# Altium schematic sheet Mainboard_MCU_Breakout.SchDoc
size A4
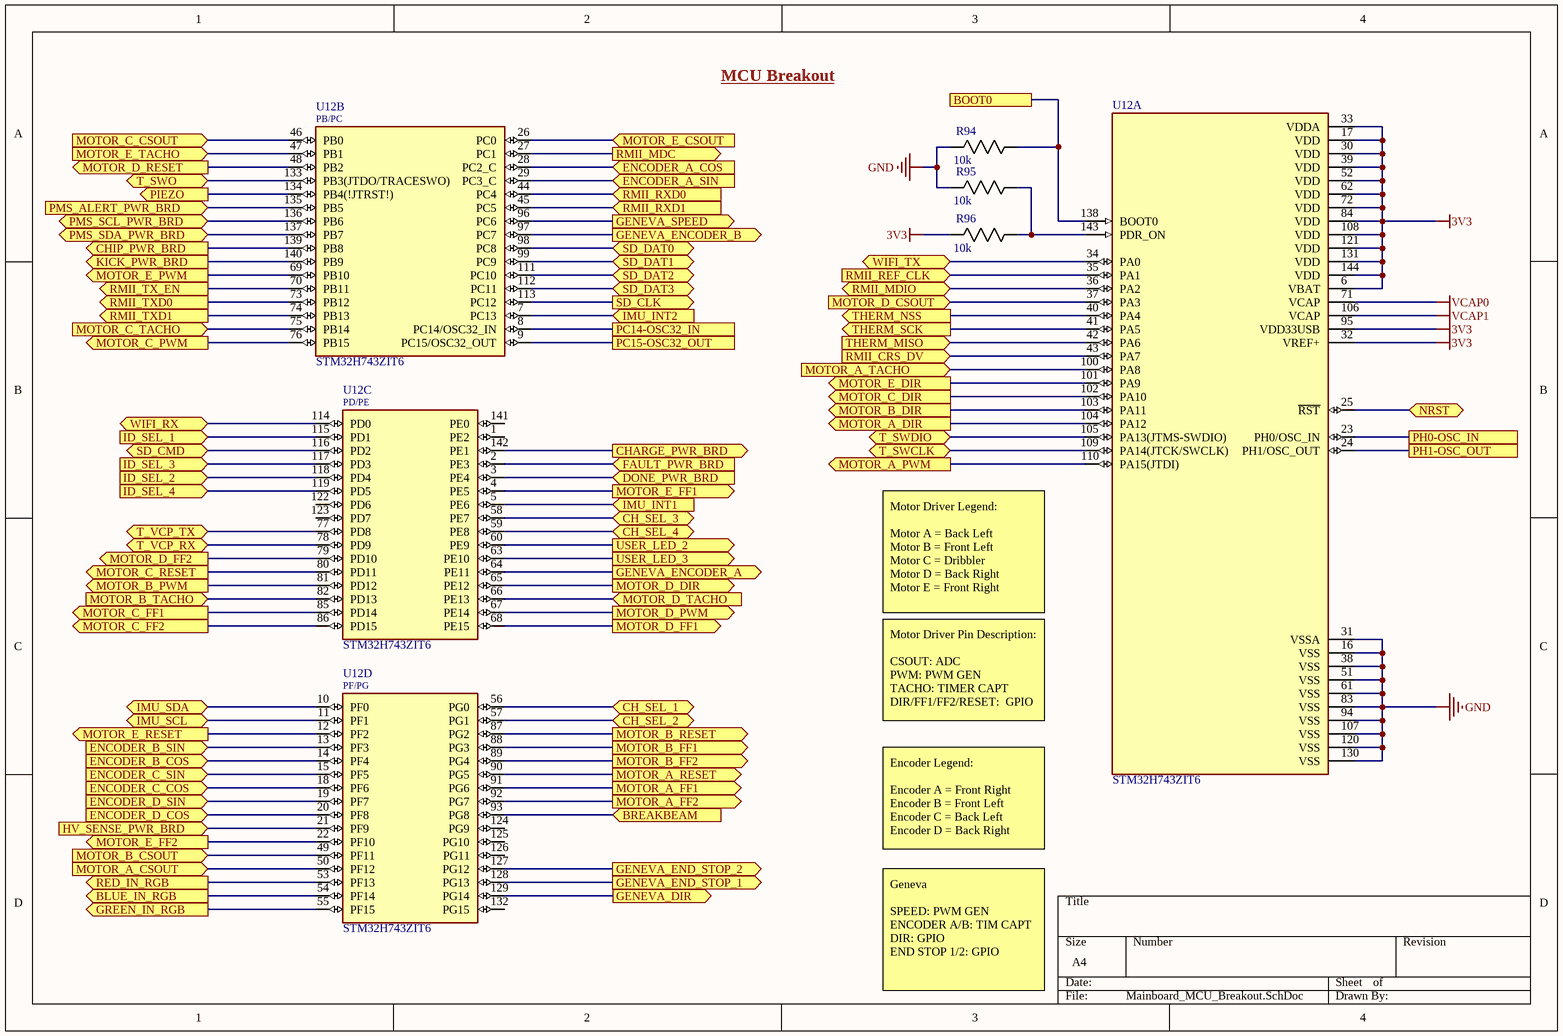
[diagram p0: Mainboard_MCU_Breakout.SchDoc]

## Parts
R94  10k  [0805]
R95  10k  [0805]
R96  10k  [0805]
U12  STM32H743ZIT6  [QFP50P2200X2200X160-144N]  (parts A,B,C,D of 4)

## Ports
BLUE_IN_RGB (out), BOOT0, BREAKBEAM (in), CH_SEL_1 (bidir), CH_SEL_2 (bidir), CH_SEL_3 (bidir), CH_SEL_4 (bidir), CHARGE_PWR_BRD (out), CHIP_PWR_BRD (out), DONE_PWR_BRD (in), ENCODER_A_COS (in), ENCODER_A_SIN (in), ENCODER_B_COS (in), ENCODER_B_SIN (in), ENCODER_C_COS (in), ENCODER_C_SIN (in), ENCODER_D_COS (in), ENCODER_D_SIN (in), FAULT_PWR_BRD (in), GENEVA_DIR (out), GENEVA_ENCODER_A (out), GENEVA_ENCODER_B (out), GENEVA_END_STOP_1 (out), GENEVA_END_STOP_2 (out), GENEVA_SPEED (out), GREEN_IN_RGB (out), HV_SENSE_PWR_BRD (in), ID_SEL_1 (in), ID_SEL_2 (in), ID_SEL_3 (in), ID_SEL_4 (in), IMU_INT1 (in), IMU_INT2 (in), IMU_SCL (bidir), IMU_SDA (bidir), KICK_PWR_BRD (out), MOTOR_A_CSOUT (in), MOTOR_A_DIR (out), MOTOR_A_FF1 (out), MOTOR_A_FF2 (out), MOTOR_A_PWM (out), MOTOR_A_RESET (out), MOTOR_A_TACHO (in), MOTOR_B_CSOUT (in), MOTOR_B_DIR (out), MOTOR_B_FF1 (out), MOTOR_B_FF2 (out), MOTOR_B_PWM (out), MOTOR_B_RESET (out), MOTOR_B_TACHO (in), MOTOR_C_CSOUT (in), MOTOR_C_DIR (out), MOTOR_C_FF1 (out), MOTOR_C_FF2 (out), MOTOR_C_PWM (out), MOTOR_C_RESET (out), MOTOR_C_TACHO (in), MOTOR_D_CSOUT (in), MOTOR_D_DIR (out), MOTOR_D_FF1 (out), MOTOR_D_FF2 (out), MOTOR_D_PWM (out), MOTOR_D_RESET (out), MOTOR_D_TACHO (in), MOTOR_E_CSOUT (in), MOTOR_E_DIR (out), MOTOR_E_FF1 (out), MOTOR_E_FF2 (out), MOTOR_E_PWM (out), MOTOR_E_RESET (out), MOTOR_E_TACHO (in), NRST (bidir), PC14-OSC32_IN, PC15-OSC32_OUT, PH0-OSC_IN, PH1-OSC_OUT, PIEZO (out), PMS_ALERT_PWR_BRD (in), PMS_SCL_PWR_BRD (bidir), PMS_SDA_PWR_BRD (bidir), RED_IN_RGB (out), RMII_CRS_DV (in), RMII_MDC (out), RMII_MDIO (bidir), RMII_REF_CLK (in), RMII_RXD0 (in), RMII_RXD1 (in), RMII_TX_EN (out), RMII_TXD0 (out), RMII_TXD1 (out), SD_CLK (out), SD_CMD (bidir), SD_DAT0 (bidir), SD_DAT1 (bidir), SD_DAT2 (bidir), SD_DAT3 (bidir), T_SWCLK (bidir), T_SWDIO (bidir), T_SWO (bidir), T_VCP_RX (bidir), T_VCP_TX (bidir), THERM_MISO (in), THERM_NSS (out), THERM_SCK (out), USER_LED_2 (out), USER_LED_3 (out), WIFI_RX (bidir), WIFI_TX (bidir)

## Nets
3V3: R96.2(R2) U12.6(VBAT) U12.17(VDD) U12.30(VDD) U12.32(VREF+) U12.33(VDDA) U12.39(VDD) U12.52(VDD) U12.62(VDD) U12.72(VDD) U12.84(VDD) U12.95(VDD33USB) U12.108(VDD) U12.121(VDD) U12.131(VDD) U12.144(VDD)
GND: R94.2(R2) R95.2(R2) U12.16(VSS) U12.31(VSSA) U12.38(VSS) U12.51(VSS) U12.61(VSS) U12.83(VSS) U12.94(VSS) U12.107(VSS) U12.120(VSS) U12.130(VSS)
VCAP0: U12.71(VCAP)
VCAP1: U12.106(VCAP)
BLUE_IN_RGB: U12.54(PF14) ; port BLUE_IN_RGB
BOOT0: R94.1(R1) U12.138(BOOT0) ; port BOOT0
BREAKBEAM: U12.93(PG8) ; port BREAKBEAM
CH_SEL_1: U12.56(PG0) ; port CH_SEL_1
CH_SEL_2: U12.57(PG1) ; port CH_SEL_2
CH_SEL_3: U12.58(PE7) ; port CH_SEL_3
CH_SEL_4: U12.59(PE8) ; port CH_SEL_4
CHARGE_PWR_BRD: U12.142(PE1) ; port CHARGE_PWR_BRD
CHIP_PWR_BRD: U12.139(PB8) ; port CHIP_PWR_BRD
DONE_PWR_BRD: U12.3(PE4) ; port DONE_PWR_BRD
ENCODER_A_COS: U12.28(PC2_C) ; port ENCODER_A_COS
ENCODER_A_SIN: U12.29(PC3_C) ; port ENCODER_A_SIN
ENCODER_B_COS: U12.14(PF4) ; port ENCODER_B_COS
ENCODER_B_SIN: U12.13(PF3) ; port ENCODER_B_SIN
ENCODER_C_COS: U12.18(PF6) ; port ENCODER_C_COS
ENCODER_C_SIN: U12.15(PF5) ; port ENCODER_C_SIN
ENCODER_D_COS: U12.20(PF8) ; port ENCODER_D_COS
ENCODER_D_SIN: U12.19(PF7) ; port ENCODER_D_SIN
FAULT_PWR_BRD: U12.2(PE3) ; port FAULT_PWR_BRD
GENEVA_DIR: U12.129(PG14) ; port GENEVA_DIR
GENEVA_ENCODER_A: U12.64(PE11) ; port GENEVA_ENCODER_A
GENEVA_ENCODER_B: U12.97(PC7) ; port GENEVA_ENCODER_B
GENEVA_END_STOP_1: U12.128(PG13) ; port GENEVA_END_STOP_1
GENEVA_END_STOP_2: U12.127(PG12) ; port GENEVA_END_STOP_2
GENEVA_SPEED: U12.96(PC6) ; port GENEVA_SPEED
GREEN_IN_RGB: U12.55(PF15) ; port GREEN_IN_RGB
HV_SENSE_PWR_BRD: U12.21(PF9) ; port HV_SENSE_PWR_BRD
ID_SEL_1: U12.115(PD1) ; port ID_SEL_1
ID_SEL_2: U12.118(PD4) ; port ID_SEL_2
ID_SEL_3: U12.117(PD3) ; port ID_SEL_3
ID_SEL_4: U12.119(PD5) ; port ID_SEL_4
IMU_INT1: U12.5(PE6) ; port IMU_INT1
IMU_INT2: U12.7(PC13) ; port IMU_INT2
IMU_SCL: U12.11(PF1) ; port IMU_SCL
IMU_SDA: U12.10(PF0) ; port IMU_SDA
KICK_PWR_BRD: U12.140(PB9) ; port KICK_PWR_BRD
MOTOR_A_CSOUT: U12.50(PF12) ; port MOTOR_A_CSOUT
MOTOR_A_DIR: U12.104(PA12) ; port MOTOR_A_DIR
MOTOR_A_FF1: U12.91(PG6) ; port MOTOR_A_FF1
MOTOR_A_FF2: U12.92(PG7) ; port MOTOR_A_FF2
MOTOR_A_PWM: U12.110(PA15(JTDI)) ; port MOTOR_A_PWM
MOTOR_A_RESET: U12.90(PG5) ; port MOTOR_A_RESET
MOTOR_A_TACHO: U12.100(PA8) ; port MOTOR_A_TACHO
MOTOR_B_CSOUT: U12.49(PF11) ; port MOTOR_B_CSOUT
MOTOR_B_DIR: U12.103(PA11) ; port MOTOR_B_DIR
MOTOR_B_FF1: U12.88(PG3) ; port MOTOR_B_FF1
MOTOR_B_FF2: U12.89(PG4) ; port MOTOR_B_FF2
MOTOR_B_PWM: U12.81(PD12) ; port MOTOR_B_PWM
MOTOR_B_RESET: U12.87(PG2) ; port MOTOR_B_RESET
MOTOR_B_TACHO: U12.82(PD13) ; port MOTOR_B_TACHO
MOTOR_C_CSOUT: U12.46(PB0) ; port MOTOR_C_CSOUT
MOTOR_C_DIR: U12.102(PA10) ; port MOTOR_C_DIR
MOTOR_C_FF1: U12.85(PD14) ; port MOTOR_C_FF1
MOTOR_C_FF2: U12.86(PD15) ; port MOTOR_C_FF2
MOTOR_C_PWM: U12.76(PB15) ; port MOTOR_C_PWM
MOTOR_C_RESET: U12.80(PD11) ; port MOTOR_C_RESET
MOTOR_C_TACHO: U12.75(PB14) ; port MOTOR_C_TACHO
MOTOR_D_CSOUT: U12.37(PA3) ; port MOTOR_D_CSOUT
MOTOR_D_DIR: U12.65(PE12) ; port MOTOR_D_DIR
MOTOR_D_FF1: U12.68(PE15) ; port MOTOR_D_FF1
MOTOR_D_FF2: U12.79(PD10) ; port MOTOR_D_FF2
MOTOR_D_PWM: U12.67(PE14) ; port MOTOR_D_PWM
MOTOR_D_RESET: U12.48(PB2) ; port MOTOR_D_RESET
MOTOR_D_TACHO: U12.66(PE13) ; port MOTOR_D_TACHO
MOTOR_E_CSOUT: U12.26(PC0) ; port MOTOR_E_CSOUT
MOTOR_E_DIR: U12.101(PA9) ; port MOTOR_E_DIR
MOTOR_E_FF1: U12.4(PE5) ; port MOTOR_E_FF1
MOTOR_E_FF2: U12.22(PF10) ; port MOTOR_E_FF2
MOTOR_E_PWM: U12.69(PB10) ; port MOTOR_E_PWM
MOTOR_E_RESET: U12.12(PF2) ; port MOTOR_E_RESET
MOTOR_E_TACHO: U12.47(PB1) ; port MOTOR_E_TACHO
NRST: U12.25(~{RST}) ; port NRST
PC14-OSC32_IN: U12.8(PC14/OSC32_IN) ; port PC14-OSC32_IN
PC15-OSC32_OUT: U12.9(PC15/OSC32_OUT) ; port PC15-OSC32_OUT
PH0-OSC_IN: U12.23(PH0/OSC_IN) ; port PH0-OSC_IN
PH1-OSC_OUT: U12.24(PH1/OSC_OUT) ; port PH1-OSC_OUT
PIEZO: U12.134(PB4(!JTRST!)) ; port PIEZO
PMS_ALERT_PWR_BRD: U12.135(PB5) ; port PMS_ALERT_PWR_BRD
PMS_SCL_PWR_BRD: U12.136(PB6) ; port PMS_SCL_PWR_BRD
PMS_SDA_PWR_BRD: U12.137(PB7) ; port PMS_SDA_PWR_BRD
RED_IN_RGB: U12.53(PF13) ; port RED_IN_RGB
RMII_CRS_DV: U12.43(PA7) ; port RMII_CRS_DV
RMII_MDC: U12.27(PC1) ; port RMII_MDC
RMII_MDIO: U12.36(PA2) ; port RMII_MDIO
RMII_REF_CLK: U12.35(PA1) ; port RMII_REF_CLK
RMII_RXD0: U12.44(PC4) ; port RMII_RXD0
RMII_RXD1: U12.45(PC5) ; port RMII_RXD1
RMII_TX_EN: U12.70(PB11) ; port RMII_TX_EN
RMII_TXD0: U12.73(PB12) ; port RMII_TXD0
RMII_TXD1: U12.74(PB13) ; port RMII_TXD1
SD_CLK: U12.113(PC12) ; port SD_CLK
SD_CMD: U12.116(PD2) ; port SD_CMD
SD_DAT0: U12.98(PC8) ; port SD_DAT0
SD_DAT1: U12.99(PC9) ; port SD_DAT1
SD_DAT2: U12.111(PC10) ; port SD_DAT2
SD_DAT3: U12.112(PC11) ; port SD_DAT3
T_SWCLK: U12.109(PA14(JTCK/SWCLK)) ; port T_SWCLK
T_SWDIO: U12.105(PA13(JTMS-SWDIO)) ; port T_SWDIO
T_SWO: U12.133(PB3(JTDO/TRACESWO)) ; port T_SWO
T_VCP_RX: U12.78(PD9) ; port T_VCP_RX
T_VCP_TX: U12.77(PD8) ; port T_VCP_TX
THERM_MISO: U12.42(PA6) ; port THERM_MISO
THERM_NSS: U12.40(PA4) ; port THERM_NSS
THERM_SCK: U12.41(PA5) ; port THERM_SCK
USER_LED_2: U12.60(PE9) ; port USER_LED_2
USER_LED_3: U12.63(PE10) ; port USER_LED_3
WIFI_RX: U12.114(PD0) ; port WIFI_RX
WIFI_TX: U12.34(PA0) ; port WIFI_TX
NetR95_1: R95.1(R1) R96.1(R1) U12.143(PDR_ON)

Not connected (* = marked no-connect by the designer): U12 1(PE2) 122(PD6) 123(PD7) 124(PG9) 125(PG10) 126(PG11) 132(PG15) 141(PE0)

## Notes on the sheet
- MCU Breakout
- Motor Driver Legend:
  Motor A = Back Left
  Motor B = Front Left
  Motor C = Dribbler
  Motor D = Back Right
  Motor E = Front Right
- Motor Driver Pin Description:
  CSOUT: ADC
  PWM: PWM GEN
  TACHO: TIMER CAPT
  DIR/FF1/FF2/RESET:  GPIO
- Encoder Legend:
  Encoder A = Front Right
  Encoder B = Front Left
  Encoder C = Back Left
  Encoder D = Back Right
- Geneva
  SPEED: PWM GEN
  ENCODER A/B: TIM CAPT
  DIR: GPIO
  END STOP 1/2: GPIO
- (in symbol STM32H743ZIT6, part B) PB/PC
- (in symbol STM32H743ZIT6, part C) PD/PE
- (in symbol STM32H743ZIT6, part D) PF/PG

## Library data of the parts
R94-R96 = RES 10k 1/8W - 1%: RES SMD 10K OHM 1% 1/8W 0805; Power (Watts): 0.125W; Package: 0805; Value: 10k; Tolerance: 1%
U12 = STM32H743ZIT6: ARM® Cortex®-M7 STM32H7 Microcontroller IC 32-Bit 480MHz 2MB (2M x 8) FLASH 144-LQFP (20x20); MF: STMicroelectronics; Package: LQFP-144 STMicroelectronics; MP: STM32H743ZIT6; ComponentLink1Description: SnapEDA; ComponentLink1URL: https://www.snapeda.com/parts/STM32H743ZIT6/STMicroelectronics/view-part/1041111/?ref=snap; ComponentLink2Description: DigiKey; ComponentLink2URL: https://www.digikey.ca/en/products/detail/stmicroelectronics/STM32H743ZIT6/7809238; ComponentLink3Description: Datasheet; ComponentLink3URL: https://www.st.com/resource/en/datasheet/stm32h743bi.pdf; DigiKey PN: 497-17721-ND